# Altium schematic sheet 5v negative and positive channels.SchDoc
size A4; SheetNumber: 6; SheetTotal: 10
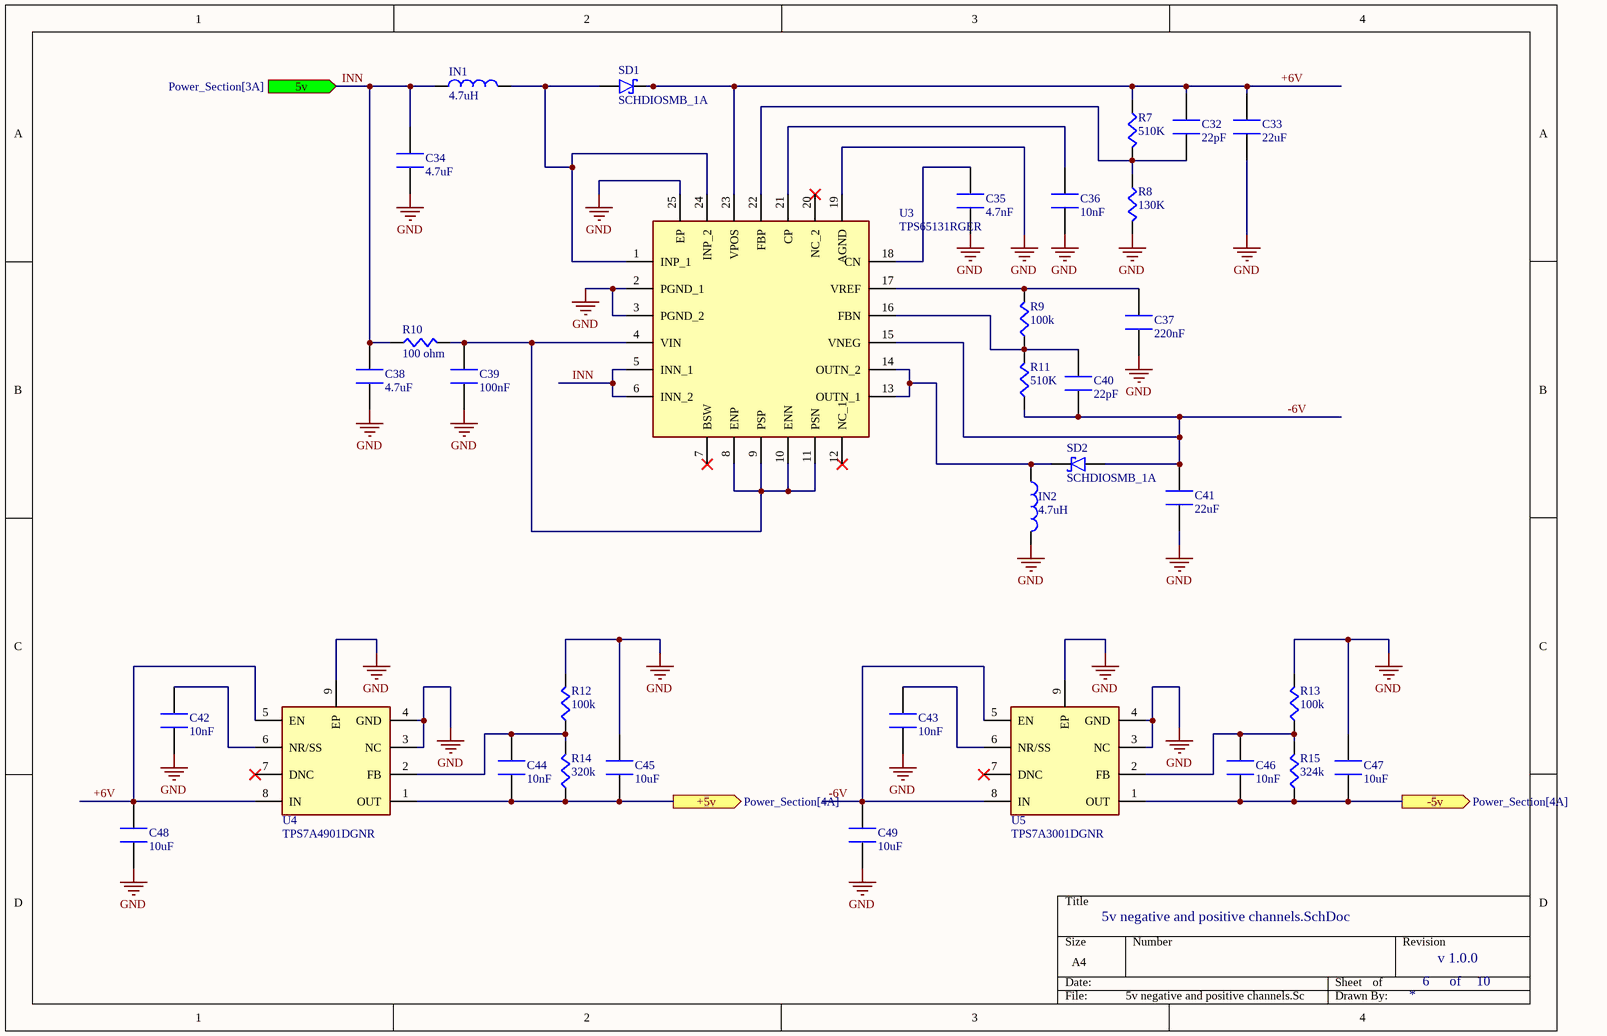
[diagram p0: 5v negative and positive channels.SchDoc]

## Parts
C32  22pF  [CAPC0603X8N]
C33  22uF  [CAPC1210X25N]
C34  4.7uF  [CAP0805X13N]
C35  4.7nF  [CAPC0603X8N]
C36  10nF  [CAPC0603X8N]
C37  220nF  [CAPC1206X18N]
C38  4.7uF  [CAP0805X13N]
C39  100nF  [CAPC0603X8N]
C40  22pF  [CAPC0603X8N]
C41  22uF  [CAPC1210X25N]
C42  10nF  [CAPC0603X8N]
C43  10nF  [CAPC0603X8N]
C44  10nF  [CAPC0603X8N]
C45  10uF  [CAPC0805X14N]
C46  10nF  [CAPC0603X8N]
C47  10uF  [CAPC0805X14N]
C48  10uF  [CAPC0805X14N]
C49  10uF  [CAPC0805X14N]
IN1  4.7uH  [INDC2520X10N]
IN2  4.7uH  [INDC2520X10N]
R7  510K  [RECS0603X45N]
R8  130K  [RECS0603X45N]
R9  100k  [RECS0603X45N]
R10  100 ohm  [RECS0603X45N]
R11  510K  [RECS0603X45N]
R12  100k  [RECS0603X45N]
R13  100k  [RECS0603X45N]
R14  320k  [RECS0603X45N]
R15  324k  [RECS0603X45N]
SD1  SCHDIOSMB_1A  [SD_SMB_1A]
SD2  SCHDIOSMB_1A  [SD_SMB_1A]
U3  TPS65131RGER  [QFN50P400X400X100-25N-D]
U4  TPS7A4901DGNR  [SOP65P490X110-9N]
U5  TPS7A3001DGNR  [SOP65P490X110-9N]

## Ports
5v (in, see Power_Section[3A]), +5v (out, see Power_Section[4A]), -5v (out, see Power_Section[4A])

## Nets
GND: C33.1 C34.1 C35.1 C36.1 C37.1 C38.1 C39.1 C41.1 C42.1 C43.1 C45.2 C47.2 C48.1 C49.1 IN2.2 R8.2 R12.2 R13.2 U3.2(PGND_1) U3.3(PGND_2) U3.19(AGND) U3.25(EP) U4.3(NC) U4.4(GND) U4.9(EP) U5.3(NC) U5.4(GND) U5.9(EP)
+5v: C44.1 C45.1 R14.1 U4.1(OUT) ; port +5v
+6V: C32.2 C33.2 C48.2 R7.1 SD1.2 U3.23(VPOS) U4.5(EN) U4.8(IN)
-5v: C46.1 C47.1 R15.1 U5.1(OUT) ; port -5v
-6V: C40.1 C41.2 C49.2 R11.1 SD2.1 U3.15(VNEG) U5.5(EN) U5.8(IN)
INN: C34.2 C38.2 IN1.1 R10.1 U3.5(INN_1) U3.6(INN_2) ; port 5v
NetC32_1: C32.1 R7.2 R8.1 U3.22(FBP)
NetC35_2: C35.2 U3.18(CN)
NetC36_2: C36.2 U3.21(CP)
NetC37_2: C37.2 R9.2 U3.17(VREF)
NetC39_2: C39.2 R10.2 U3.4(VIN) U3.8(ENP) U3.9(PSP) U3.10(ENN) U3.11(PSN)
NetC40_2: C40.2 R9.1 R11.2 U3.16(FBN)
NetC42_2: C42.2 U4.6(NR/SS)
NetC43_2: C43.2 U5.6(NR/SS)
NetC44_2: C44.2 R12.1 R14.2 U4.2(FB)
NetC46_2: C46.2 R13.1 R15.2 U5.2(FB)
NetIN1_2: IN1.2 SD1.1 U3.1(INP_1) U3.24(INP_2)
NetIN2_1: IN2.1 SD2.2 U3.13(OUTN_1) U3.14(OUTN_2)

Not connected (* = marked no-connect by the designer): U3 7(BSW)* 12(NC_1)* 20(NC_2)*; U4 7(DNC)*; U5 7(DNC)*

## Notes on the sheet
- v 1.0.0
- of

## Library data of the parts
C32 C40 = CC0603_22pF_NPO: C105620, CC0603JRNPO9BN220, 22pF 50V NP0 ±5% 0603 Multilayer Ceramic Capacitors MLCC - SMD/SMT ROHS; Supplier 1: element14 APAC; Supplier Part Number 1: CC0603JRNPO9BN220
C33 C41 = CC1210_22uF_X7R: C309062, CL32B226KAJNNNE, 22uF 25V X7R ±10% 1210 Multilayer Ceramic Capacitors MLCC - SMD/SMT ROHS; Supplier 1: Avnet; Supplier Part Number 1: CL32B226KAJNNNE
C34 C38 = CC0805_4.7uF_X7R: C354262, CC0805KKX7R8BB475, 25V 4.7uF X7R ±10% 0805 Multilayer Ceramic Capacitors MLCC - SMD/SMT ROHS; Supplier 1: element14 APAC; Supplier Part Number 1: CC0805KKX7R8BB475
C35 = CC0603_4.7nF_X7R: C106218, CC0603KRX7R9BB472, 4.7nF 50V X7R ±10% 0603 Multilayer Ceramic Capacitors MLCC - SMD/SMT ROHS; Supplier 1: element14 APAC; Supplier Part Number 1: CC0603KRX7R9BB472
C36 C42-C44 C46 = CC0603_10nF_X7R: C100042, CC0603KRX7R9BB103, 10nF 50V X7R ±10% 0603 Multilayer Ceramic Capacitors MLCC - SMD/SMT ROHS; Supplier 1: element14 APAC; Supplier Part Number 1: CC0603KRX7R9BB103
C37 = CC0603_220nF_NPO: C464977, GRM31C5C1H224JE02L, 220nF 50V C0G ±5% 1206 Multilayer Ceramic Capacitors MLCC - SMD/SMT ROHS; Supplier 1: Chip One Stop; Supplier Part Number 1: GRM31C5C1H224JE02L
C39 = CC0603_100nF_X7R: C14663, CC0603KRX7R9BB104, 100nF 50V X7R ±10% 0603 Multilayer Ceramic Capacitors MLCC - SMD/SMT ROHS; Supplier 1: element14 APAC; Supplier Part Number 1: CC0603KRX7R9BB104
C45 C47-C49 = CC0805_10uF_X7R: C95841, CL21B106KOQNNNE, 10uF 16V X7R ±10% 0805 Multilayer Ceramic Capacitors MLCC - SMD/SMT ROHS; Supplier 1: Avnet; Supplier Part Number 1: CL21B106KOQNNNE
IN1 IN2 = IN2520_4.7uH_1A: C91237, MLP2520S4R7MT0S1, 130mΩ 1A 4.7uH Multilayer inductor ±20% 1008 Inductors (SMD) ROHS; Supplier 1: element14 APAC; Supplier Part Number 1: MLP2520S4R7MT0S1
R7 R11 = RESC0603_510K_THICK: C114066, RC0603FR-07510KL, -55℃~+155℃ 100mW 510kΩ 75V Thick Film Resistor ±1% ±100ppm/℃ 0603 Chip Resistor - Surface Mount ROHS; Supplier 1: element14 APAC; Supplier Part Number 1: RC0603FR-07510KL
R8 = RESC0603_130K_THICK: C163432, RC0603FR-07130KL, -55℃~+155℃ 100mW 130kΩ 75V Thick Film Resistor ±1% ±100ppm/℃ 0603 Chip Resistor - Surface Mount ROHS; Supplier 1: element14 APAC; Supplier Part Number 1: RC0603FR-07130KL
R9 R12 R13 = RESC0603_100K_THIN: C116674, AC0603FR-07100KL, -55℃~+155℃ 100kΩ 100mW 75V Thick Film Resistor ±1% ±100ppm/℃ 0603 Chip Resistor - Surface Mount ROHS; Supplier 1: element14 APAC; Supplier Part Number 1: AC0603FR-07100KL
R10 = RESC0603_100_THIN: C122970, RT0603BRD07100RL, -55℃~+155℃ 100mW 100Ω 75V Thin Film Resistor ±0.1% ±25ppm/℃ 0603 Chip Resistor - Surface Mount ROHS; Supplier 1: element14 APAC; Supplier Part Number 1: RT0603BRD07100RL
R14 = RESC0603_320K_THIN: C20165692, RT0603BRD07320KL, -55℃~+155℃ 100mW 320kΩ 75V Thin Film Resistor ±0.1% ±25ppm/℃ 0603 Chip Resistor - Surface Mount ROHS; Supplier 1: element14 APAC; Supplier Part Number 1: RT0603BRD07320KL
R15 = RESC0603_324K_THIN: C861321, RT0603BRD07324KL, -55℃~+155℃ 100mW 324kΩ 75V Thin Film Resistor ±0.1% ±25ppm/℃ 0603 Chip Resistor - Surface Mount ROHS; Supplier 1: Verical; Supplier Part Number 1: RT0603BRD07324KL
SD1 SD2 = SCHDIOSMB_1A: C86598, STPS160U, 1 Independent 1A 4uA@60V 60V 670mV@1A 75A SMB Schottky Diodes ROHS; Supplier 1: element14 APAC; Supplier Part Number 1: STPS160U
U3 = TPS65131RGER: C87663, TPS65131RGER, -15V~-2V、500mV~15V -40℃~+85℃@(TA)、-40℃~+125℃@(TJ) 1.25MHz~1.5MHz 1.95A 2 2.7V~5.5V 500uA Adjustable Boost、Inverting Buck-Boost Built-in No QFN-24-EP(4x4) DC-DC Converters ROHS; Manufacturer_Name: Texas Instruments; Datasheet Link: http://www.ti.com/general/docs/suppproductinfo.tsp?distId=10&gotoUrl=http%3A%2F%2Fwww.ti.com%2Flit%2Fgpn%2Ftps65130; Height: 1mm; Manufacturer_Part_Number: TPS65131RGER; Mouser Part Number: 595-TPS65131RGER; Mouser Price/Stock: https://www.mouser.co.uk/ProductDetail/Texas-Instruments/TPS65131RGER?qs=Gse6rAGbi7988IP%2FxurOIw%3D%3D; Arrow Part Number: TPS65131RGER; Arrow Price/Stock: https://www.arrow.com/en/products/tps65131rger/texas-instruments.html?utm_currency=USD&region=nac; Supplier 1: Arrow Electronics; Supplier Part Number 1: TPS65131RGER
U4 = TPS7A4901DGNR: C16430, TPS7A4901DGNR,  -40℃~+125℃@(Tj) 1 1.194V~33V 15.4uVrms 150mA 260mV@(100mA) 35V 49uA 72dB@(120Hz) Adjustable Positive Under Voltage Lockout、Over Current Protection、Over Temperature Protection、Enable HVSSOP-8 Voltage Regulators - Linear, Low Drop Out (LDO) Regulators ROHS; Manufacturer_Name: Texas Instruments; Datasheet Link: http://www.ti.com/lit/ds/sbvs121b/sbvs121b.pdf; Height: 1.1mm; Manufacturer_Part_Number: TPS7A4901DGNR; Mouser Part Number: 595-TPS7A4901DGNR; Mouser Price/Stock: https://www.mouser.co.uk/ProductDetail/Texas-Instruments/TPS7A4901DGNR?qs=Ze4%2FuFuz19J1%252B3gTImnAgQ%3D%3D; Arrow Part Number: TPS7A4901DGNR; Arrow Price/Stock: https://www.arrow.com/en/products/tps7a4901dgnr/texas-instruments?utm_currency=USD&region=europe; Supplier 1: Arrow Electronics; Supplier Part Number 1: TPS7A4901DGNR
U5 = TPS7A3001DGNR: C33835, TPS7A3001DGNR, -40℃~+125℃@(Tj) 1 1.18V~33V 15.1uVrms 200mA 216mV@(100mA) 36V 55uA 72dB@(120Hz) Adjustable Negative Over Current Protection、Enable、Thermal Shutdown HVSSOP-8 Voltage Regulators - Linear, Low Drop Out (LDO) Regulators ROHS; Manufacturer_Name: Texas Instruments; Datasheet Link: http://www.ti.com/lit/ds/symlink/tps7a30.pdf; Height: 1.1mm; Manufacturer_Part_Number: TPS7A3001DGNR; Mouser Part Number: 595-TPS7A3001DGNR; Mouser Price/Stock: https://www.mouser.co.uk/ProductDetail/Texas-Instruments/TPS7A3001DGNR?qs=Ze4%2FuFuz19IOnYFqkI4X3Q%3D%3D; Arrow Part Number: TPS7A3001DGNR; Arrow Price/Stock: https://www.arrow.com/en/products/tps7a3001dgnr/texas-instruments?region=nac; Supplier 1: Arrow Electronics; Supplier Part Number 1: TPS7A3001DGNR